# Altium schematic sheet BSPD.SchDoc
size A4
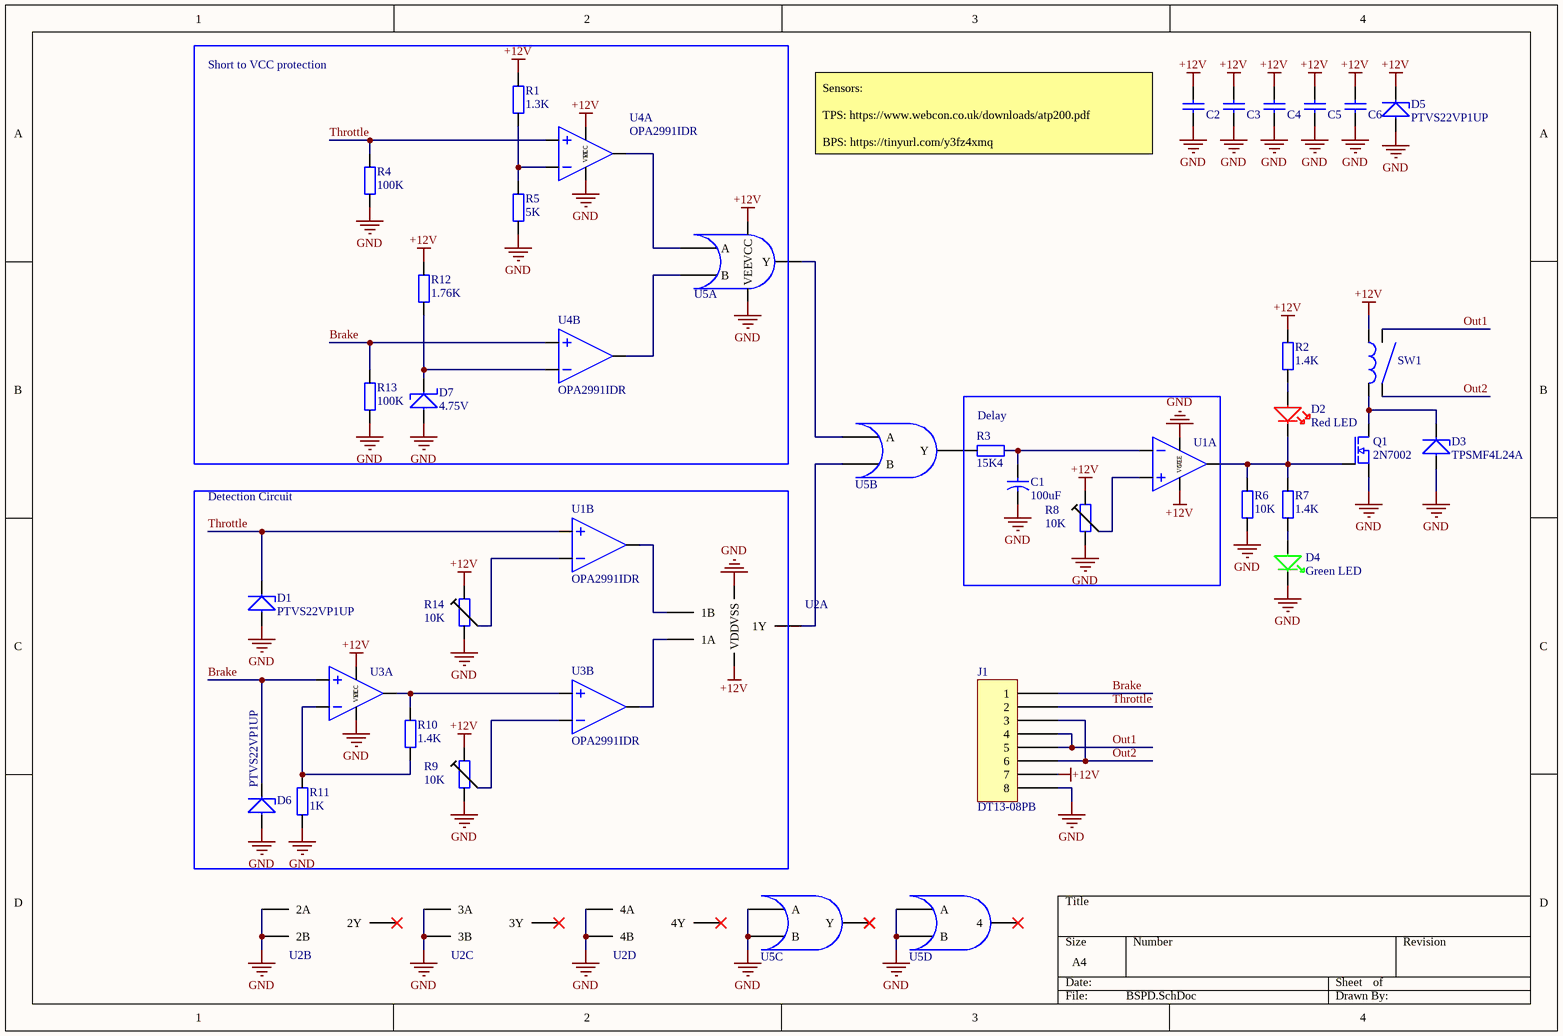
[diagram p0: BSPD.SchDoc]

## Parts
C1  100uF  [CAPAE660X770D660L220X65N]
C2  100nF  [CAPC160X80X87L35N]  (value not drawn)
C3  100nF  [CAPC160X80X87L35N]  (value not drawn)
C4  100nF  [CAPC160X80X87L35N]  (value not drawn)
C5  100nF  [CAPC160X80X87L35N]  (value not drawn)
C6  100nF  [CAPC160X80X87L35N]  (value not drawn)
D1  PTVS22VP1UP  [SODFL470X250X110L130X175N]
D2  Red LED  [LEDC160X80X50L30N]
D3  TPSMF4L24A  [SODFL470X250X110L130X175N]
D4  Green LED  [LEDC160X80X50L30N]
D5  PTVS22VP1UP  [SODFL470X250X110L130X175N]
D6  PTVS22VP1UP  [SODFL470X250X110L130X175N]
D7  4.75V  [SODFL360X160X130L80X100N]
J1  DT13-08PB  [DT13-08PB]
Q1  2N7002  [SOT23-3P95_230X110L30X43N]
R1  1.3K  [RESC160X80X55L30N]
R2  1.4K  [RESC160X80X50L30N]
R3  15K4  [RESC160X80X50L30N]
R4  100K  [RESC160X80X50L30N]
R5  5K  [RESC160X80X55L30N]
R6  10K  [RESC160X80X50L30N]
R7  1.4K  [RESC160X80X50L30N]
R8  10K  [RESDFN3_475X200X100L160X130N]
R9  10K  [RESDFN3_475X200X100L160X130N]
R10  1.4K  [RESC160X80X50L30N]
R11  1K  [RESC160X80X50L30N]
R12  1.76K  [RESC160X80X50L30N]
R13  100K  [RESC160X80X50L30N]
R14  10K  [RESDFN3_475X200X100L160X130N]
SW1  SPST-NO  [655414191282]  (value not drawn)
U1  OPA2991IDR  [SOIC8P127_490X599X175L84X41N]  (value not drawn)  (parts A,B of 2)
U2  HEF4081BT  [SOIC14P127_865X600X175L70X42N]  (value not drawn)  (parts A,B,C,D of 4)
U3  OPA2991IDR  [SOIC8P127_490X599X175L84X41N]  (value not drawn)  (parts A,B of 2)
U4  OPA2991IDR  [SOIC8P127_490X599X175L84X41N]  (parts A,B of 2)
U5  HEF4071B  [SOIC14P127_865X600X175L70X42N]  (value not drawn)  (parts A,B,C,D of 4)

## Blocks framed on the sheet
Short to VCC protection: D7 R1 R4 R5 R12 R13 U4 U5
Delay: C1 R3 R8 U1
Detection Circuit: D1 D6 R9-R11 R14 U1-U3

## Nets
+12V: C2.1 C3.1 C4.1 C5.1 C6.1 D5.C J1.7 R1.1 R2.1 R8.3 R9.3 R12.1 R14.3 SW1.1 U1.8(VCC) U2.14(VDD) U3.8(VCC) U4.8(VCC) U5.14(VCC)
GND: C1.2 C2.2 C3.2 C4.2 C5.2 C6.2 D1.A D3.A D4.C D5.A D6.A D7.A J1.8 Q1.2(S) R4.2 R5.2 R6.1 R8.1 R9.1 R11.1 R13.2 R14.1 U1.4(VEE) U2.5(2A) U2.6(2B) U2.7(VSS) U2.8(3A) U2.9(3B) U2.12(4A) U2.13(4B) U3.4(VEE) U4.4(VEE) U5.7(VEE) U5.8(A) U5.9(B) U5.12(A) U5.13(B)
Brake: D6.C J1.1 R13.1 U3.3 U4.5
Out1: J1.4 J1.5 SW1.3
Out2: J1.3 J1.6 SW1.4
Throttle: D1.C J1.2 R4.1 U1.5 U4.3
NetC1_1: C1.1 R3.1 U1.2
NetD2_A: D2.A R2.2
NetD2_C: D2.C Q1.1(G) R6.2 R7.1 U1.1
NetD3_C: D3.C Q1.3(D) SW1.2
NetD4_A: D4.A R7.2
NetD7_C: D7.C R12.2 U4.6
NetR1_2: R1.2 R5.1 U4.2
NetR3_2: R3.2 U5.4(Y)
NetR8_2: R8.2 U1.3
NetR9_2: R9.2 U3.6
NetR10_1: R10.1 R11.2 U3.2
NetR10_2: R10.2 U3.1 U3.5
NetR14_2: R14.2 U1.6
NetU1_7: U1.7 U2.2(1B)
NetU2_1: U2.1(1A) U3.7
NetU2_3: U2.3(1Y) U5.6(B)
NetU4_1: U4.1 U5.1(A)
NetU4_7: U4.7 U5.2(B)
NetU5_3: U5.3(Y) U5.5(A)

Not connected (* = marked no-connect by the designer): U2 4(2Y)* 10(3Y)* 11(4Y)*; U5 10(Y)* 11(4)*

## Notes on the sheet
- (near C2) Sensors:
  TPS: https://www.webcon.co.uk/downloads/atp200.pdf
  BPS: https://tinyurl.com/y3fz4xmq

## Library data of the parts
C1 = C_100uF_25V: Manufacturer Part Number: 865080445010; Voltage Rating: 25 V; Capacitor Case Style: Radial; ComponentLinkDescription: Datasheet; FR_SN: C_P-07; Part Number: C_100uF_25V; Value: 100uF; ComponentLinkURL: https://hr.mouser.com/datasheet/2/445/865080445010-1726566.pdf; Supplier Part Number: 710-865080445010
C2-C6 = C_0603_100nF_50V: Manufacturer Part Number: CC0603MRY5V9BB104; Voltage Rating: 50V; Capacitor Case Style: 0603; ComponentLinkDescription: Datasheet; FR_SN: C_NP-02; Part Number: C_0603_100nF_50V; Value: 100nF; ComponentLinkURL: https://hr.mouser.com/datasheet/2/212/KEM_C1027_X7; Supplier Part Number: 603-C0603MRY5V9BB104
D1 D5 D6 = TVS_22V: Manufacturer Part Number: PTVS22VP1UP,115; Diode Case Style: SOD-128; Stand-off Voltage: 22V; Peak Pulse Power: 600W; ComponentLinkDescription: Datasheet; FR_SN: TVS-02; Part Number: TVS_22V; Value: PTVS22VP1UP; ComponentLinkURL: https://hr.mouser.com/datasheet/2/916/PTVSXP1UP_SER-1320701.pdf; Supplier Part Number: 771-PTVS22VP1UP115
D2 = LED_Red_60mcd: Manufacturer Part Number: 150060SS75000; Max Reverse Voltage: 5V; Diode Case Style: 0603; Forward Current: 20mA; ComponentLinkDescription: Datasheet; FR_SN: D_LED-03; Part Number: LED_Red_60mcd; Value: Red LED; Diode Type: LED; ComponentLinkURL: https://hr.mouser.com/datasheet/2/445/150060SS75000-368982.pdf; Supplier Part Number: 710-150060SS75000
D3 = TVS_24V: Diode Case Style: SOD-123; Stand-off Voltage: 24V; Peak Pulse Power: 400W; ComponentLinkDescription: Datasheet; FR_SN: TVS_03; Part Number: TVS_24V; Value: TPSMF4L24A; Manufacturer Part Number: TPSMF4L24A; ComponentLinkURL: https://hr.mouser.com/datasheet/2/240/Littelfuse_TVS_Diode_TPSMF4L_Datasheet.pdf-952419.pdf; Supplier Part Number: 576-TPSMF4L24A
D4 = LED_Green_20mcd@12V,1.4K: Manufacturer Part Number: 150060VS55040; Max Reverse Voltage: 5V; Diode Case Style: SMD; Forward Current: 20mA; ComponentLinkDescription: Datasheet; FR_SN: D_LED-02; Part Number: LED_Green_20mcd@12V,1.4K; Value: Green LED; Diode Type: LED; ComponentLinkURL: https://hr.mouser.com/datasheet/2/445/150060VS55040-1313752.pdf; Supplier Part Number: 710-150060VS55040
D7 = D_4.75V_625mW: Manufacturer Part Number: PDZ4.7BGWX; Tolerance: 2 %; Power Dissipation: 625mW; Diode Case Style: SOD-123-2; ComponentLinkDescription: Datasheet; FR_SN: D_Z-03; Part Number: D_4.75V_625mW; Voltage Rating: 4.75V; Value: 4.75V; ComponentLinkURL: https://hr.mouser.com/datasheet/2/916/PDZ-GW_SER-1599748.pdf; Supplier Part Number: 771-PDZ4.7BGWX
J1 = DT13-08PB 2x4: ComponentLinkDescription: Datasheet; FR_SN: J-17; Part Number: DT13-08PB 2x4; Value: DT13-08PB; Manufacturer Part Number: DT13-08PB; ComponentLinkURL: https://www.te.com/commerce/DocumentDelivery/DDEController?Action=srchrtrv&DocNm=DT13-08PX&DocType=Customer+Drawing&DocLang=English&PartCntxt=DT13-08PB&DocFormat=pdf; Supplier Part Number: 571-DT13-08PB
Q1 = Q_N_GSD: On Resistance Rds(on): 1.2 Ohms; Power Dissipation Pd: 200 mW; Continuous Drain Current Id: 120 mA; Drain Source Voltage Uds: 60 V; Transistor Case Style: SOT-23-3; ComponentLinkDescription: Datasheet; FR_SN: T_M-03; Part Number: Q_N_GSD; Value: 2N7002; Manufacturer Part Number: 2N7002; ComponentLinkURL: https://hr.mouser.com/ProductDetail/ON-Semiconductor-Fairchild/2N7002?qs=0dwsXDNhqlz66WJJhrTFjQ%3D%3D; Supplier Part Number: 512-2N7002
R1 = R_0603_1.3K_0W1_C: Manufacturer Part Number: ERJ-3EKF1301V; Power Rating: 100mW; Resistor Case Style: 0603; Temperature Coefficient: 100 PPM / C; FR_SN: R-56; Part Number: R_0603_1.3K_0W1_C; Value: 1.3K; ComponentLink1URL: https://hr.mouser.com/datasheet/2/315/AOA0000C304-1149620.pdf; ComponentLink1Description: Datasheet; Supplier Part Number: 667-ERJ-3EKF1301V
R2 R7 R10 = R_0603_1.4K_0W1: Manufacturer Part Number: RT0603DRE071K4L; Power Rating: 100mW; Resistor Case Style: 0603; Temperature Coefficient: 50 PPM / C; FR_SN: R-06; Part Number: R_0603_1.4K_0W1; Value: 1.4K; ComponentLink1URL: https://hr.mouser.com/datasheet/2/447/PYu-RT_1-to-0.01_RoHS_L_9-1222720.pdf; ComponentLink1Description: Datasheet; Supplier Part Number: 603-RT0603DRE071K4L
R3 = R_0603_15.4K_0W062: Manufacturer Part Number: APC0603B15K4N; Power Rating: 62.5mW; Resistor Case Style: 0603; Temperature Coefficient: 25 PPM/C; FR_SN: R-53; Part Number: R_0603_15.4K_0W062; Value: 15K4; ComponentLink1URL: https://hr.mouser.com/datasheet/2/303/APC-1-15.34-911303.pdf; ComponentLink1Description: Datasheet; Supplier Part Number: 284-APC0603B15K4N
R4 R13 = R_0603_100K_0W1_C: Manufacturer Part Number: CRCW0603100KFKEAC; Power Rating: 100mW; Resistor Case Style: 0603; Temperature Coefficient: 100 PPM / C; FR_SN: R-34; Part Number: R_0603_100K_0W1_C; Value: 100K; ComponentLink1URL: https://hr.mouser.com/datasheet/2/427/crcwce3-1223726.pdf; ComponentLink1Description: Datasheet; Supplier Part Number: 71-CRCW0603100KFKEAC
R5 = R_0603_5K_0W1_P_C: Manufacturer Part Number: RT0603BRE075KL; Power Rating: 100mW; Resistor Case Style: 0603; Temperature Coefficient: 50 PPM / C; FR_SN: R-55; Part Number: R_0603_5K_0W1_P_C; Value: 5K; ComponentLink1URL: https://hr.mouser.com/datasheet/2/447/PYu-RT_1-to-0.01_RoHS_L_11-1669912.pdf; ComponentLink1Description: Datasheet; Supplier Part Number: 603-RT0603BRE075KL
R6 = R_0603_10K_0W062_P: Manufacturer Part Number: APC0603B10K0N; Power Rating: 62.5mW; Resistor Case Style: 0603; Temperature Coefficient: 25 PPM / C; FR_SN: R-11; Part Number: R_0603_10K_0W062_P; Value: 10K; ComponentLink1URL: https://hr.mouser.com/datasheet/2/303/APC-1-15.34-911303.pdf; ComponentLink1Description: Datasheet; Supplier Part Number: 284-APC0603B10K0N
R8 R9 R14 = Trimmer_10K_0W250: Manufacturer Part Number: PVG5A103C03B00; Power Rating: 250mW; Resistor Case Style: Vertical; Temperature Coefficient: 150 PPM/C; FR_SN: Trim-02; Part Number: Trimmer_10K_0W250; Value: 10K; ComponentLink1Description: Datasheet; Supplier Part Number: 81-PVG5A103C03B00; ComponentLink1URL: https://hr.mouser.com/datasheet/2/54/pvg5-907351.pdf
R11 = R_0603_1K_0W1: Manufacturer Part Number: CRCW06031K00FKEAC; Power Rating: 100mW; Resistor Case Style: 0603; Temperature Coefficient: 100 PPM / C; FR_SN: R-01; Part Number: R_0603_1K_0W1; Value: 1K; ComponentLink1URL: https://hr.mouser.com/ProductDetail/Vishay/CRCW06031K00FKEAC?qs=sGAEpiMZZMtlubZbdhIBIIZe04wfiaJW%2fzoax%252b8jFdk%3d; ComponentLink1Description: Datasheet; Supplier Part Number: 71-CRCW06031K00FKEAC
R12 = R_0603_1.76K_0W1_P: Manufacturer Part Number: RT0603BRD071K76L; Power Rating: 100mW; Resistor Case Style: 0603; Temperature Coefficient: 25 PPM / C; FR_SN: R-15; Part Number: R_0603_1.76K_0W1_P; Value: 1.76K; ComponentLink1URL: https://hr.mouser.com/ProductDetail/Yageo/RT0603BRD071K76L?qs=sGAEpiMZZMu61qfTUdNhGyjxuWj6R%252BAvNaA7oRf469yqgHOwdPrDqQ%3D%3D; ComponentLink1Description: Datasheet; Supplier Part Number: 603-RT0603BRD071K76L
SW1 = Relay_Non-L_TH: Manufacturer Part Number: 4-1419128-2; Switch Case Style: Relay; ComponentLinkDescription: Datasheet; FR_SN: SW-03; Part Number: Relay_Non-L_TH; Value: SPST-NO; Type: Non-Latching; Configuration: SPST-NO; ComponentLinkURL: https://www.te.com/commerce/DocumentDelivery/DDEController?Action=srchrtrv&DocNm=1461104&DocType=Customer+Drawing&DocLang=English&PartCntxt=4-1419128-2&DocFormat=pdf; Supplier Part Number: 655-4-1419128-2
U1 U3 U4 = OPA2991IDR: IC Case Style: SOIC-8; ComponentLinkDescription: Datasheet; FR_SN: U_Analog-08; Part Number: OPA2991IDR; Value: OPA2991IDR; Category: Dual Chanel OP Amp; Manufacturer Part Number: OPA2991IDR; ComponentLinkURL: http://www.ti.com/lit/ds/symlink/opa2991.pdf; Supplier Part Number: 595-OPA2991IDR
U2 = HEF4081BT: Manufacturer Part Number: HEF4081BT,653; IC Case Style: SO-14; ComponentLinkDescription: Datasheet; FR_SN: IC_Misc-20; Part Number: HEF4081BT; Value: HEF4081BT; Category: Logic AND Gate; ComponentLinkURL: https://hr.mouser.com/datasheet/2/916/HEF4081B_Q100-1599374.pdf; Supplier Part Number: 771-HEF4081BTD-T
U5 = HEF4071B: Manufacturer Part Number: HEF4071BT,653; IC Case Style: SO-14; ComponentLinkDescription: Datasheet; FR_SN: IC_Misc-21; Part Number: HEF4071B; Value: HEF4071B; Category: Logic OR Gate; ComponentLinkURL: https://hr.mouser.com/datasheet/2/916/HEF4071B-1599180.pdf; Supplier Part Number: 771-HEF4071BTD-T